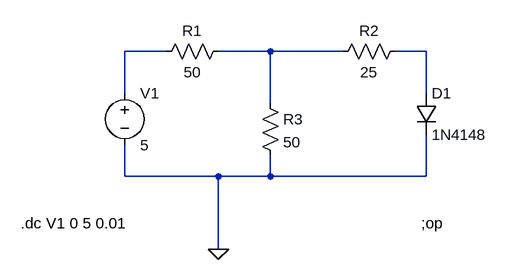
[diagram p0: schematic Draft3.asc]
Draft3.asc, the LTspice schematic file:
Version 4
SHEET 1 880 680
WIRE 96 80 32 80
WIRE 256 80 176 80
WIRE 368 80 256 80
WIRE 496 80 448 80
WIRE 32 144 32 80
WIRE 496 144 496 80
WIRE 256 160 256 80
WIRE 32 272 32 224
WIRE 176 272 32 272
WIRE 256 272 256 240
WIRE 256 272 176 272
WIRE 496 272 496 208
WIRE 496 272 256 272
WIRE 176 384 176 272
FLAG 176 384 0
SYMBOL voltage 32 128 R0
SYMATTR InstName V1
SYMATTR Value 5
SYMBOL res 192 64 R90
WINDOW 0 0 56 VBottom 2
WINDOW 3 32 56 VTop 2
SYMATTR InstName R1
SYMATTR Value 50
SYMBOL res 464 64 R90
WINDOW 0 0 56 VBottom 2
WINDOW 3 32 56 VTop 2
SYMATTR InstName R2
SYMATTR Value 25
SYMBOL diode 480 144 R0
SYMATTR InstName D1
SYMATTR Value 1N4148
SYMBOL res 240 144 R0
SYMATTR InstName R3
SYMATTR Value 50
TEXT 488 344 Left 2 !;op
TEXT -128 344 Left 2 !.dc V1 0 5 0.01

The netlist it stands for:
* Draft3.asc
V1 N001 0 5
R1 N002 N001 50
R2 N003 N002 25
D1 N003 0 1N4148
R3 N002 0 50
.model D D
.lib standard.dio
;op
.dc V1 0 5 0.01
.backanno
.end